# Altium schematic sheet Sheet1.SchDoc
size A
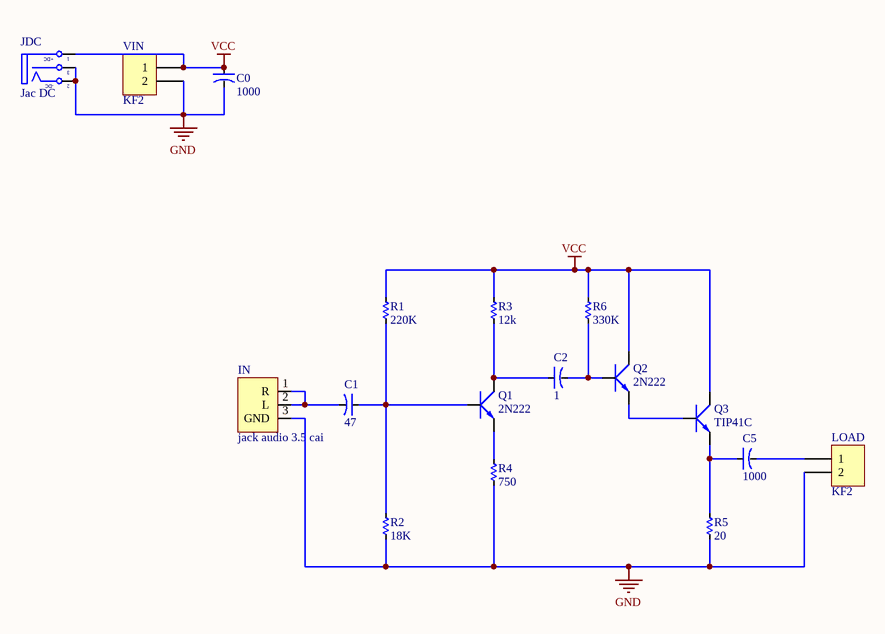
[diagram p0: Sheet1.SchDoc]

## Parts
C0  1000  [CA-ALU-8]
C1  47  [CA-ALU-6.3]
C2  1  [CA-ALU-6.3]
C5  1000  [CA-ALU-13BL]
IN  jack audio 3.5 cai  [Jack audio 3.5 PJ-313]
JDC  Jac DC  [DC5]
LOAD  KF2  [KF2-5.08]
Q1  2N222  [TO92-123]
Q2  2N222  [TO92-123]
Q3  TIP41C  [TO220-123]
R1  220K  [RES-1/4W]
R2  18K  [RES-1/4W]
R3  12k  [RES-1/4W]
R4  750  [RES-1/4W]
R5  20  [RES-5W]
R6  330K  [RES-1/4W]
VIN  KF2  [KF2-5.08]

## Nets
GND: C0.2 IN.3(GND) JDC.2(TN) JDC.3(S) LOAD.2 R2.2 R4.2 R5.2 VIN.2
VCC: C0.1 JDC.1(T) Q2.3(C) Q3.2(C) R1.1 R3.1 R6.1 VIN.1
NetC1_1: C1.1 Q1.2(B) R1.2 R2.1
NetC1_2: C1.2 IN.1(R) IN.2(L)
NetC2_1: C2.1 Q1.3(C) R3.2
NetC2_2: C2.2 Q2.2(B) R6.2
NetC5_1: C5.1 Q3.3(E) R5.1
NetC5_2: C5.2 LOAD.1
NetQ1_1: Q1.1(E) R4.1
NetQ2_1: Q2.1(E) Q3.1(B)

## Notes on the sheet
- (in symbol DCIN) +DC; -DC

## Library data of the parts
C0-C2 C5 = CN-ALU-DIP: Capacitor (Semiconductor SIM Model); Value: 104; LatestRevisionDate: 17-Jul-2002; LatestRevisionNote: Re-released for DXP Platform.; PackageReference: C1206; Publisher: Altium Limited
JDC = DCIN: Jac DC input; Value: Jac DC
LOAD VIN = KF2: Manufacturer: Würth Elektronik eiSos GmbH; partNo: 691103110002; ComponentLink1 Description: Manufacturer; ComponentLink2 Description: Datasheet; NoPins: 2; Created Date: 29 October 2013; ComponentLink1URL: http://www.we-online.com; ComponentLink2URL: http://katalog.we-online.de/em/datasheet/6911031100xx.pdf; Created by: Karrer Zheng
Q1 Q2 = 2N222: NPN 600mW, ECB; Value: C1815
Q3 = TIP41C: NPN 2W, BCE; Value: TIP41C
R1-R6 = Res: Manufacturer: Generic Components; Class: Passive; SubClass: R; Published: 08/06/2000; Publisher: Altium Hobart Technology Centre